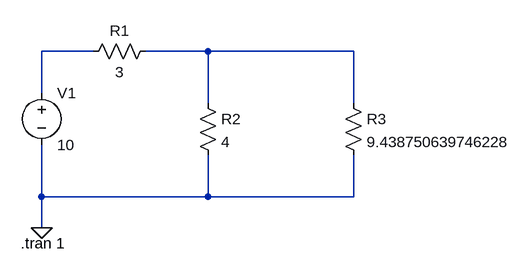
[diagram p0: schematic showfile.asc]
showfile.asc, the LTspice schematic file:
Version 4
SHEET 1 880 680
WIRE 144 32 64 32
WIRE 320 32 224 32
WIRE 544 32 320 32
WIRE 64 96 64 32
WIRE 320 112 320 32
WIRE 544 112 544 32
WIRE 64 256 64 176
WIRE 320 256 320 192
WIRE 320 256 64 256
WIRE 544 256 544 192
WIRE 544 256 320 256
WIRE 64 304 64 256
FLAG 64 304 0
SYMBOL voltage 64 80 R0
WINDOW 123 0 0 Left 0
WINDOW 39 0 0 Left 0
SYMATTR InstName V1
SYMATTR Value 10
SYMBOL res 240 16 R90
WINDOW 0 0 56 VBottom 2
WINDOW 3 32 56 VTop 2
SYMATTR InstName R1
SYMATTR Value 3
SYMBOL res 304 96 R0
SYMATTR InstName R2
SYMATTR Value 4
SYMBOL res 528 96 R0
SYMATTR InstName R3
SYMATTR Value 9.438750639746228
TEXT 32 328 Left 2 !.tran 1

The netlist it stands for:
* showfile.asc
V1 N001 0 10
R1 N002 N001 3
R2 N002 0 4
R3 N002 0 9.438750639746228
.tran 1
.backanno
.end